# EasyEDA schematic SCH_usb-hub_2025-07-20.json
TITLE: Sheet_1; REV: 1.0; Date: 2025-07-19; Sheet: 1/1; Drawn By: krunchiekrunch; Company: Your Company
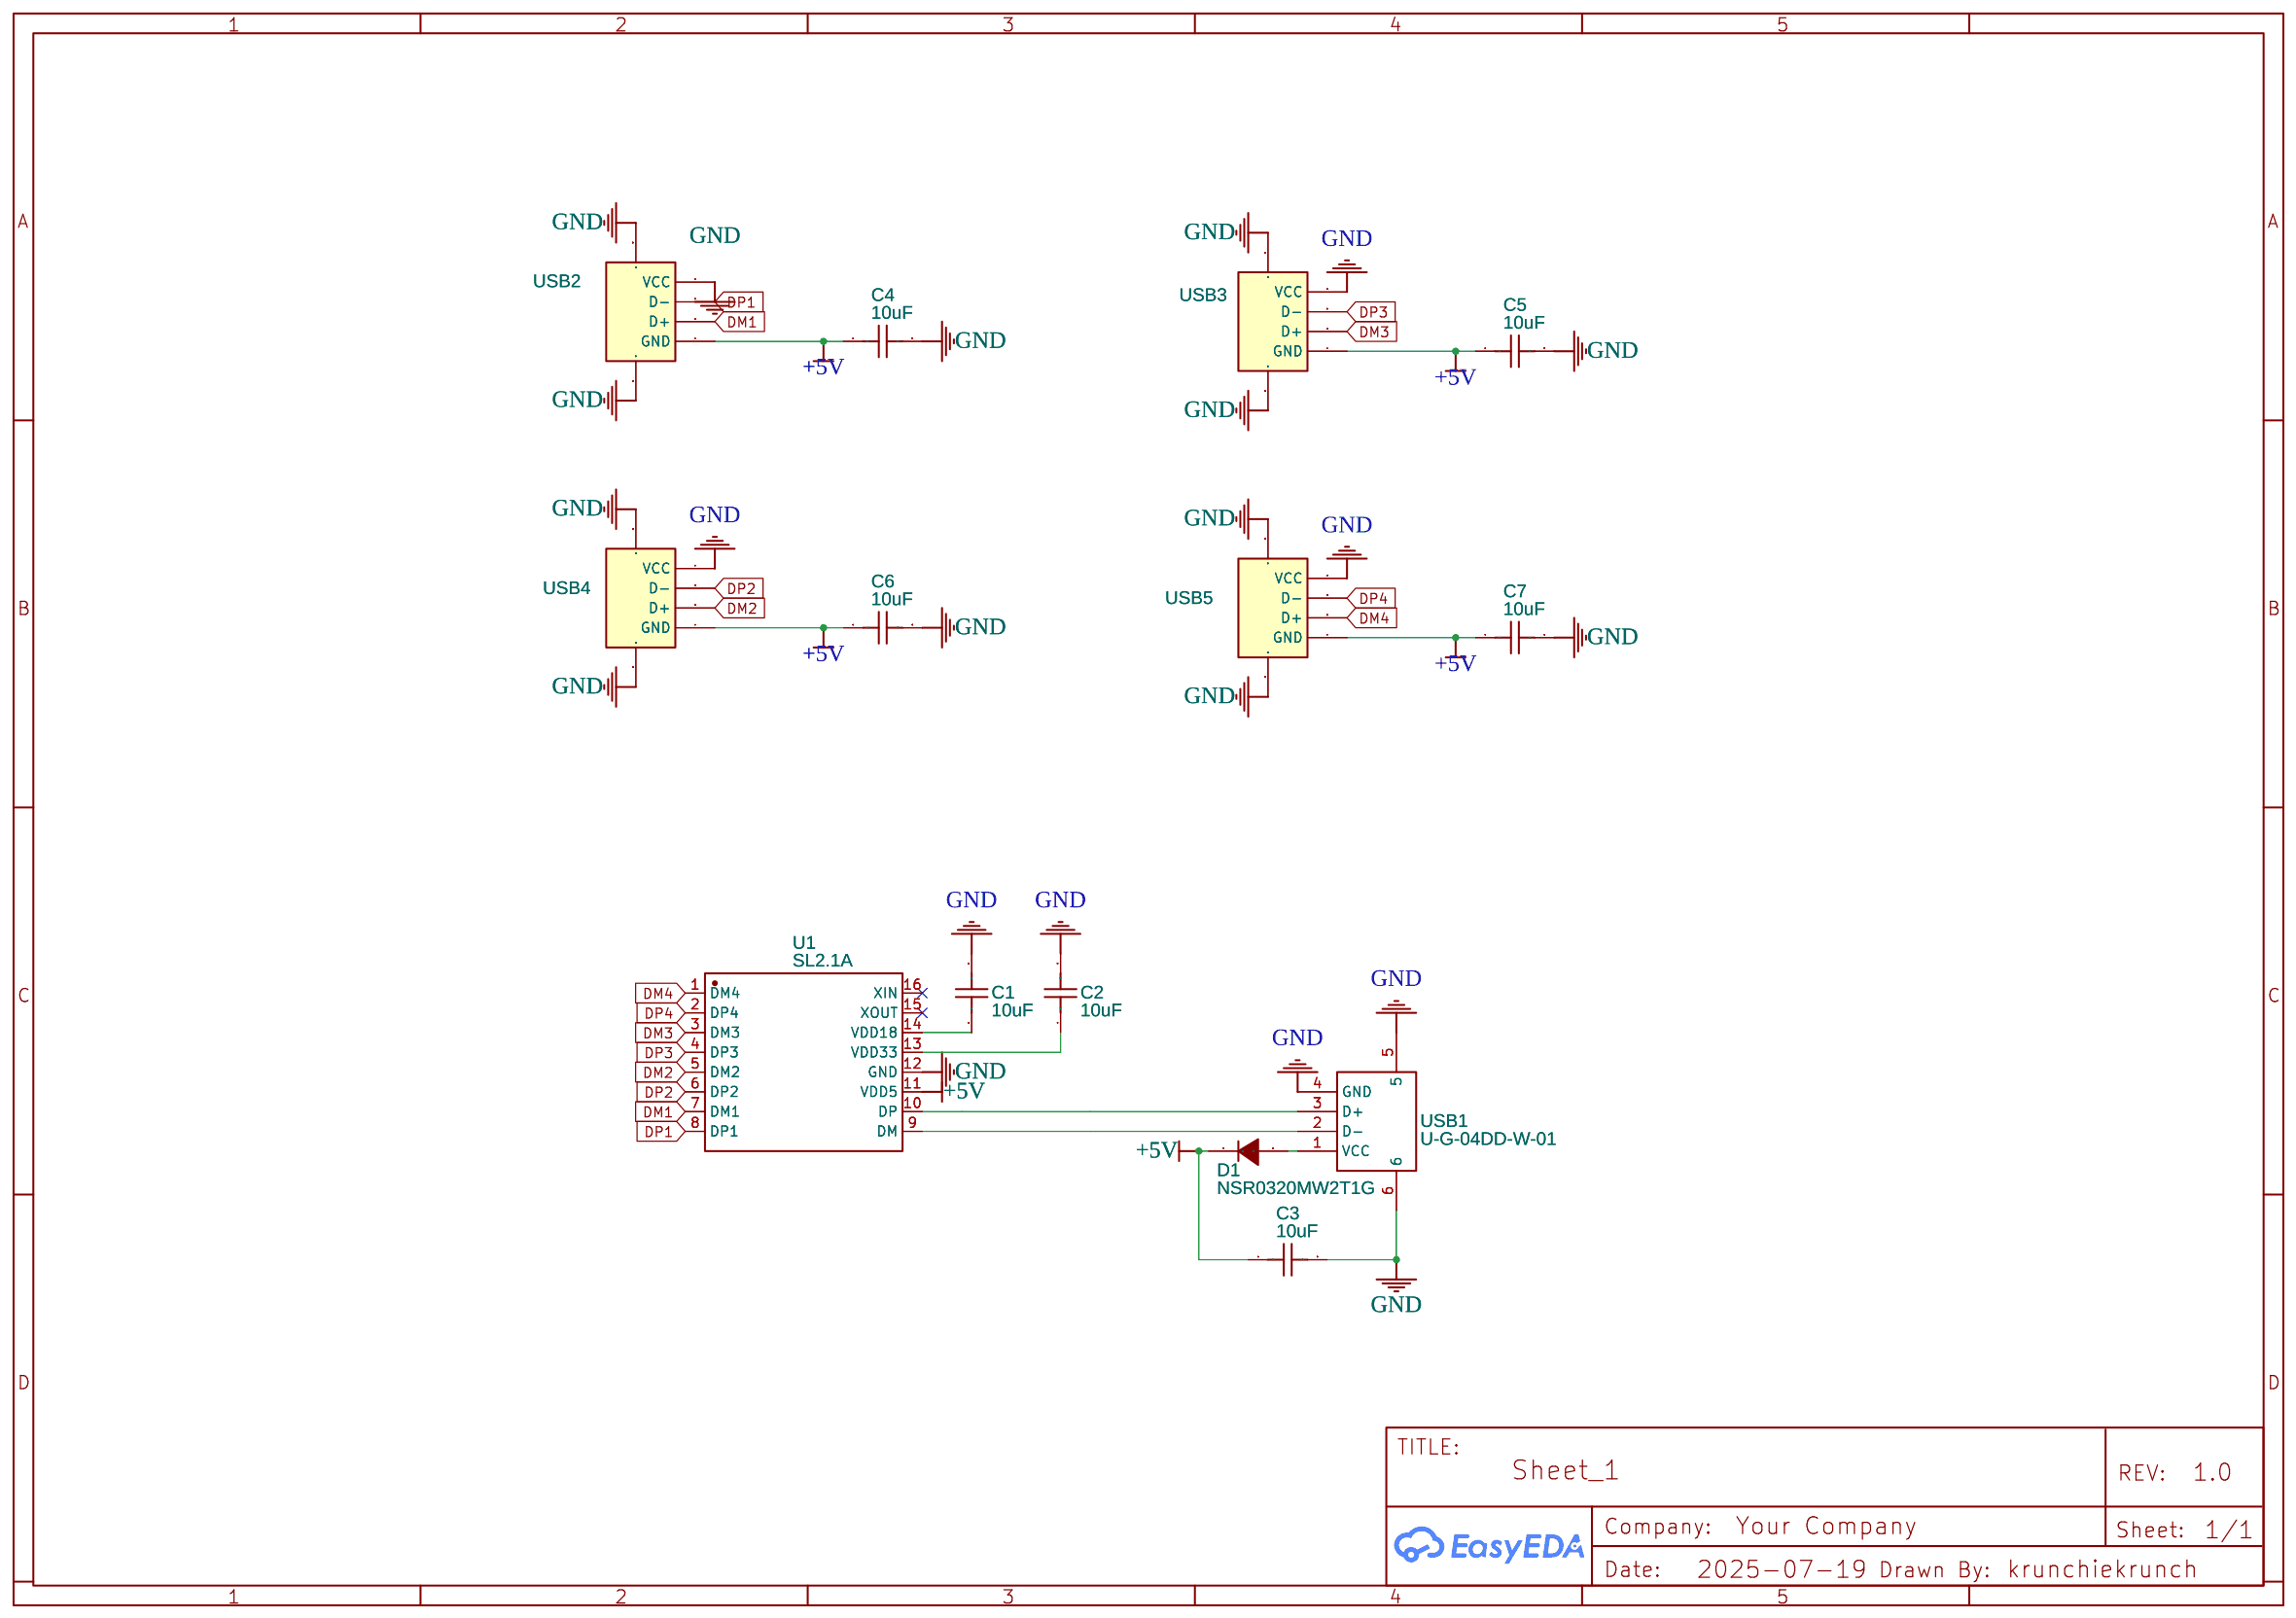
[diagram p0: schematic sheet]

## Parts
C1  10uF  [C0805]
C2  10uF  [C0805]
C3  10uF  [C0805]
C4  10uF  [C0805]
C5  10uF  [C0805]
C6  10uF  [C0805]
C7  10uF  [C0805]
D1  NSR0320MW2T1G  [SOD-323_L1.8-W1.3-LS2.5-RD]
U1  SL2.1A  [SOP-16_L10.0-W3.9-P1.27-LS6.0-BL]
USB1  U-G-04DD-W-01  [USB-A-TH_U-G-04WD-W-01]
USB2  USB A/F 90° Outside the buckle straight foot  [USB-A-TH_USB-M-1_C2346]
USB3  USB A/F 90° Outside the buckle straight foot  [USB-A-TH_USB-M-1_C2346]
USB4  USB A/F 90° Outside the buckle straight foot  [USB-A-TH_USB-M-1_C2346]
USB5  USB A/F 90° Outside the buckle straight foot  [USB-A-TH_USB-M-1_C2346]

## Library data of the parts
C1-C7 = CL21A106KAYNNNE: Supplier: LCSC; Manufacturer: SAMSUNG(三星); Supplier Part: C15850; JLCPCB Part Class: Basic Part
D1 = NSR0320MW2T1G: Supplier: LCSC; Manufacturer: onsemi(安森美); Supplier Part: C48192; JLCPCB Part Class: Extended Part
U1 = SL2.1A: Contributor: LCSC; Supplier: LCSC; Supplier Part: C192893; Manufacturer: CoreChips(和芯润德); JLCPCB Part Class: Extended Part
USB1 = U-G-04DD-W-01: Supplier: LCSC; Manufacturer: 韩国韩荣; Manufacturer Part: U-G-O4DD-W-1; Supplier Part: C98125; JLCPCB Part Class: Extended Part
USB2-USB5 = USB A/F 90° Outside the buckle straight foot: Supplier: LCSC; Manufacturer: 精拓金; Manufacturer Part: 901-211A1021D10100; Supplier Part: C2346; JLCPCB Part Class: Extended Part

## Nets
+5V: C3.1 C4.1 C5.1 C6.1 C7.1 D1.1(C) U1.11(VDD5) USB2.4(GND) USB3.4(GND) USB4.4(GND) USB5.4(GND)
GND: C1.2 C2.2 C3.2 C4.2 C5.2 C6.2 C7.2 U1.12(GND) USB1.4(GND) USB1.5 USB1.6 USB2.0 USB2.1(VCC) USB3.0 USB3.1(VCC) USB4.0 USB4.1(VCC) USB5.0 USB5.1(VCC)
DM1: U1.7(DM1) USB2.3(D+)
DM2: U1.5(DM2) USB4.3(D+)
DM3: U1.3(DM3) USB3.3(D+)
DM4: U1.1(DM4) USB5.3(D+)
DP1: U1.8(DP1) USB2.2(D-)
DP2: U1.6(DP2) USB4.2(D-)
DP3: U1.4(DP3) USB3.2(D-)
DP4: U1.2(DP4) USB5.2(D-)
Net-(C1-1): C1.1 U1.14(VDD18)
Net-(C2-1): C2.1 U1.13(VDD33)
Net-(D1-2): D1.2(A) USB1.1(VCC)
Net-(U1-9): U1.9(DM) USB1.2(D-)
Net-(U1-10): U1.10(DP) USB1.3(D+)

Not connected (* = marked no-connect by the designer): U1 15(XOUT)* 16(XIN)*
